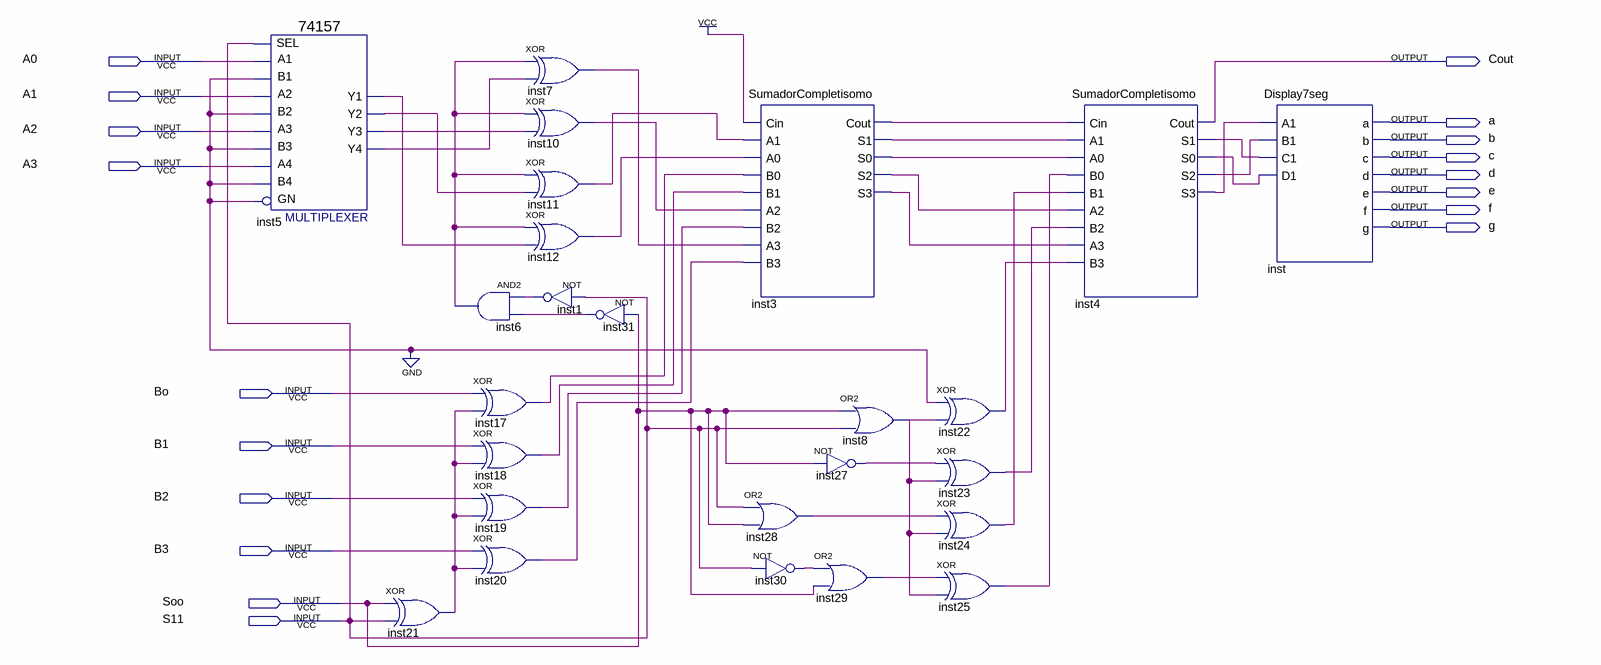
[diagram p0: schematic sheet]
// Quartus schematic ParteAritmetica.bdf as structural Verilog: 25 symbols, 18 pins
module ParteAritmetica (
  input  A0,
  input  A1,
  input  A2,
  input  A3,
  input  Bo,
  input  B1,
  input  B2,
  input  B3,
  input  Soo,
  input  S11,
  output Cout,
  output a,
  output b,
  output c,
  output d,
  output e,
  output f,
  output g
);

  wire inst1_out, inst3_cout, inst3_s0, inst3_s1, inst3_s2, inst3_s3, inst4_s0, inst4_s1, inst4_s2, inst4_s3,
       inst5_y1, inst5_y2, inst5_y3, inst5_y4, inst6_out, inst7_out, inst8_out, inst10_out, inst11_out,
       inst12_out, inst17_out, inst18_out, inst19_out, inst20_out, inst21_out, inst22_out, inst23_out,
       inst24_out, inst25_out, inst27_out, inst28_out, inst29_out, inst30_out, inst31_out;

  \74157  inst5 (
    .A1(A0), .B1(1'b0), .SEL(S11), .B2(1'b0), .A3(A2), .B3(1'b0), .A2(A1), .B4(1'b0), .GN(1'b0), .A4(A3),
    .Y2(inst5_y2), .Y1(inst5_y1), .Y4(inst5_y4), .Y3(inst5_y3));
  xor inst21 (inst21_out, Soo, S11);
  and inst6 (inst6_out, inst1_out, inst31_out);
  xor inst17 (inst17_out, Bo, inst21_out);
  xor inst18 (inst18_out, B1, inst21_out);
  xor inst19 (inst19_out, B2, inst21_out);
  xor inst20 (inst20_out, B3, inst21_out);
  xor inst7 (inst7_out, inst6_out, inst5_y4);
  xor inst10 (inst10_out, inst6_out, inst5_y3);
  xor inst11 (inst11_out, inst6_out, inst5_y2);
  xor inst12 (inst12_out, inst6_out, inst5_y1);
  not inst1 (inst1_out, S11);
  not inst31 (inst31_out, Soo);
  SumadorCompletisomo inst3 (
    .Cin(1'b1), .A1(inst11_out), .A0(inst12_out), .B0(inst17_out), .B1(inst18_out), .A2(inst10_out),
    .B2(inst19_out), .A3(inst7_out), .B3(inst20_out), .Cout(inst3_cout), .S1(inst3_s1), .S0(inst3_s0),
    .S2(inst3_s2), .S3(inst3_s3));
  or inst28 (inst28_out, S11, Soo);
  not inst30 (inst30_out, S11);
  or inst8 (inst8_out, Soo, S11);
  not inst27 (inst27_out, Soo);
  or inst29 (inst29_out, inst30_out, Soo);
  xor inst22 (inst22_out, 1'b0, inst8_out);
  xor inst23 (inst23_out, inst27_out, inst8_out);
  xor inst24 (inst24_out, inst28_out, inst8_out);
  xor inst25 (inst25_out, inst29_out, inst8_out);
  SumadorCompletisomo inst4 (
    .Cin(inst3_cout), .A1(inst3_s1), .A0(inst3_s0), .B0(inst25_out), .B1(inst24_out), .A2(inst3_s2),
    .B2(inst23_out), .A3(inst3_s3), .B3(inst22_out), .Cout(Cout), .S1(inst4_s1), .S0(inst4_s0),
    .S2(inst4_s2), .S3(inst4_s3));
  Display7seg inst (
    .A1(inst4_s3), .B1(inst4_s2), .C1(inst4_s1), .D1(inst4_s0), .a(a), .b(b), .c(c), .d(d), .e(e), .f(f),
    .g(g));
endmodule
